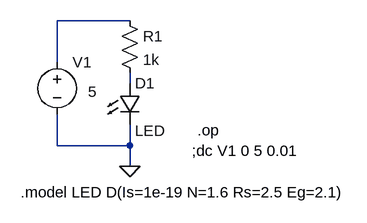
[diagram p0: schematic ledx.asc]
ledx.asc, the LTspice schematic file:
Version 4
SHEET 1 880 680
WIRE 96 32 -16 32
WIRE -16 96 -16 32
WIRE 96 128 96 112
WIRE -16 224 -16 176
WIRE 96 224 96 192
WIRE 96 224 -16 224
WIRE 96 256 96 224
FLAG 96 256 0
SYMBOL voltage -16 80 R0
WINDOW 3 48 61 Left 2
WINDOW 123 0 0 Left 2
WINDOW 39 0 0 Left 2
SYMATTR Value 5
SYMATTR InstName V1
SYMBOL res 80 16 R0
SYMATTR InstName R1
SYMATTR Value 1k
SYMBOL LED 80 128 R0
WINDOW 3 24 73 Left 2
SYMATTR Value LED
SYMATTR InstName D1
TEXT -72 296 Left 2 !.model LED D(Is=1e-19 N=1.6 Rs=2.5 Eg=2.1)
TEXT 192 232 Left 2 !;dc V1 0 5 0.01
TEXT 200 200 Left 2 !.op

The netlist it stands for:
* ledx.asc
V1 N001 0 5
R1 N001 N002 1k
D1 N002 0 LED
.model D D
.lib standard.dio
.model LED D(Is=1e-19 N=1.6 Rs=2.5 Eg=2.1)
;dc V1 0 5 0.01
.op
.backanno
.end